# Altium schematic sheet TOP.SchDoc
size A4; SheetNumber: 1; SheetTotal: 4
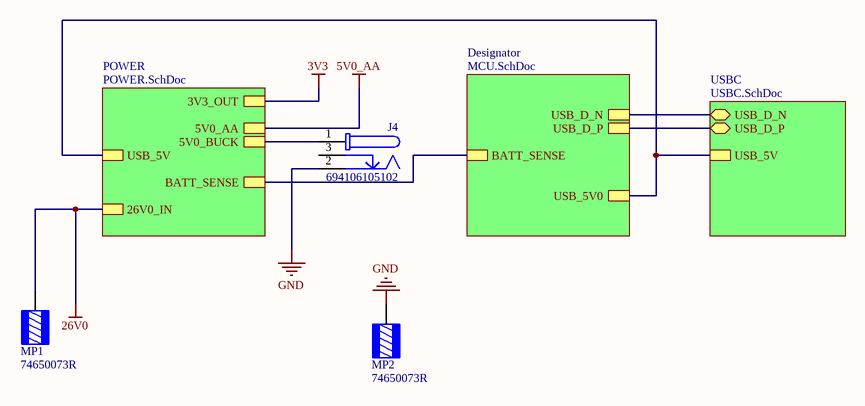
[diagram p0: TOP.SchDoc]

## Parts
J4  694106105102  [694106105102]
MP1  74650073R  [WURTH 74650073]
MP2  74650073R  [WURTH 74650073]

## Sub-sheets
Designator = MCU.SchDoc: USB_D_N, USB_D_P, USB_5V0, BATT_SENSE
POWER = POWER.SchDoc: 26V0_IN, 5V0_AA, 3V3_OUT, USB_5V, BATT_SENSE, 5V0_BUCK
USBC = USBC.SchDoc: USB_D_N (bidir), USB_D_P (bidir), USB_5V

## Nets
3V3: sheet POWER/3V3_OUT
5V0_AA: sheet POWER/5V0_AA
26V0: MP1.1 ; sheet POWER/26V0_IN
GND: J4.2 MP2.1
NetJ4_1: J4.1 ; sheet POWER/5V0_BUCK
(unnamed): sheet POWER/USB_5V, sheet Designator/USB_5V0, sheet USBC/USB_5V
(unnamed): sheet POWER/BATT_SENSE, sheet Designator/BATT_SENSE
(unnamed): sheet Designator/USB_D_N, sheet USBC/USB_D_N
(unnamed): sheet Designator/USB_D_P, sheet USBC/USB_D_P

Not connected (* = marked no-connect by the designer): J4 3

## Library data of the parts
J4 = CMP-1502-00176-3: DC Power Jack Connector with Pegs WR-DC, Male, Right Angled, SMT, 5 A, 24 V; Voltage Rating: 24V; Insulation Resistance: 100MΩ; Current Rating: 5A; Shielding: Unshielded; Number of Contacts: 3; Contact Gender: Female; Min Operating Temperature: -40°C; REACH SVHC: Unknown; Flammability Rating: UL94 V-0; Contact Material: Gold; Housing Material: Polyamide; Operating Supply Voltage: 24V; Mount: Surface Mount; Packaging: Tape and Reel; Max Operating Temperature: 85°C; Termination: SMD/SMT; Height: 11.2mm; Voltage Rating (DC): 24V; Contact Plating: Tin; Connector Type: Power; Color: Black; Gender: Male; RoHS: Compliant
MP1 MP2 = 74650073R: TERM REDCUBE M3 4PIN PCB; Manufacturer: Würth Elektronik; Current Rating (Amps): 50 A; Part Number: 74650073R; ComponentLink1Description: Datasheet; ComponentLink1URL: https://katalog.we-online.de/em/datasheet/74650073R.pdf; ComponentLink2Description: DigiKey Link; ComponentLink2URL: https://www.digikey.com/en/products/detail/würth-elektronik/74650073R/6643978; Features: Screw not Included; LastUpdated: 8/7/2022 8:38:54 PM; Lifecycle Status: Active; Minimum Order: 1; Mounting Type: Through Hole; Number of Pins: 4; Packaging: TapeAndReel; Part Status: Active; Price: 2.28; Screw Size: M3; Series: REDCUBE WP-THRBU; Supplier 1: DigiKey; Supplier Part Number 1: 732-10882-1-ND; Terminal Type: Screw Terminal, Power Tap; Termination: Solder